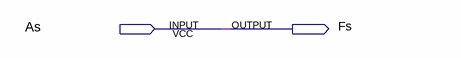
[diagram p0: schematic sheet]
// Quartus schematic sinal.bdf as structural Verilog: 0 symbols, 2 pins
module sinal (
  input  As,
  output Fs
);


  assign Fs = As;
endmodule
